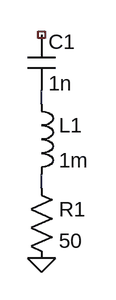
[diagram p0: schematic demod.asc]
demod.asc, the LTspice schematic file:
Version 4
SHEET 1 880 680
WIRE -48 112 -48 96
WIRE -48 208 -48 192
FLAG -48 288 0
SYMBOL cap -64 32 R0
SYMATTR InstName C1
SYMATTR Value 1n
SYMBOL ind -64 96 R0
SYMATTR InstName L1
SYMATTR Value 1m
SYMBOL res -64 192 R0
SYMATTR InstName R1
SYMATTR Value 50

The netlist it stands for:
* demod.asc
C1 NC_01 N001 1n
L1 N001 N002 1m
R1 N002 0 50
.backanno
.end